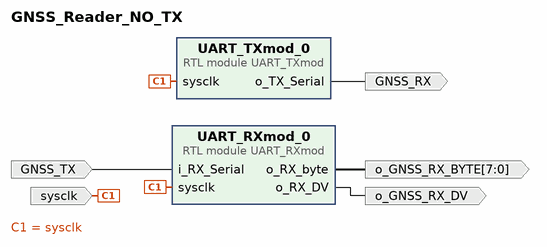
[diagram p0: block diagram of the top level]
# Vivado block design GNSS_Reader_NO_TX, xc7a35tcpg236-1, Vivado 2024.2
create_bd_design GNSS_Reader_NO_TX

create_bd_port -dir I sysclk
create_bd_port -dir I GNSS_TX
create_bd_port -dir O GNSS_RX
create_bd_port -dir O o_GNSS_RX_DV
create_bd_port -dir O -from 7 -to 0 o_GNSS_RX_BYTE

create_bd_cell -type module -reference UART_RXmod UART_RXmod_0
create_bd_cell -type module -reference UART_TXmod UART_TXmod_0

# ---- connections ----

connect_bd_net [get_bd_ports GNSS_TX] [get_bd_pins UART_RXmod_0/i_RX_Serial]
connect_bd_net [get_bd_pins UART_RXmod_0/o_RX_DV] [get_bd_ports o_GNSS_RX_DV]
connect_bd_net [get_bd_pins UART_RXmod_0/o_RX_byte] [get_bd_ports o_GNSS_RX_BYTE]
connect_bd_net [get_bd_pins UART_TXmod_0/o_TX_Serial] [get_bd_ports GNSS_RX]
connect_bd_net [get_bd_ports sysclk] [get_bd_pins UART_RXmod_0/sysclk] [get_bd_pins UART_TXmod_0/sysclk]

validate_bd_design
save_bd_design
